# EAGLE design Rocket_End_Relays (EAGLE 7.3.0)
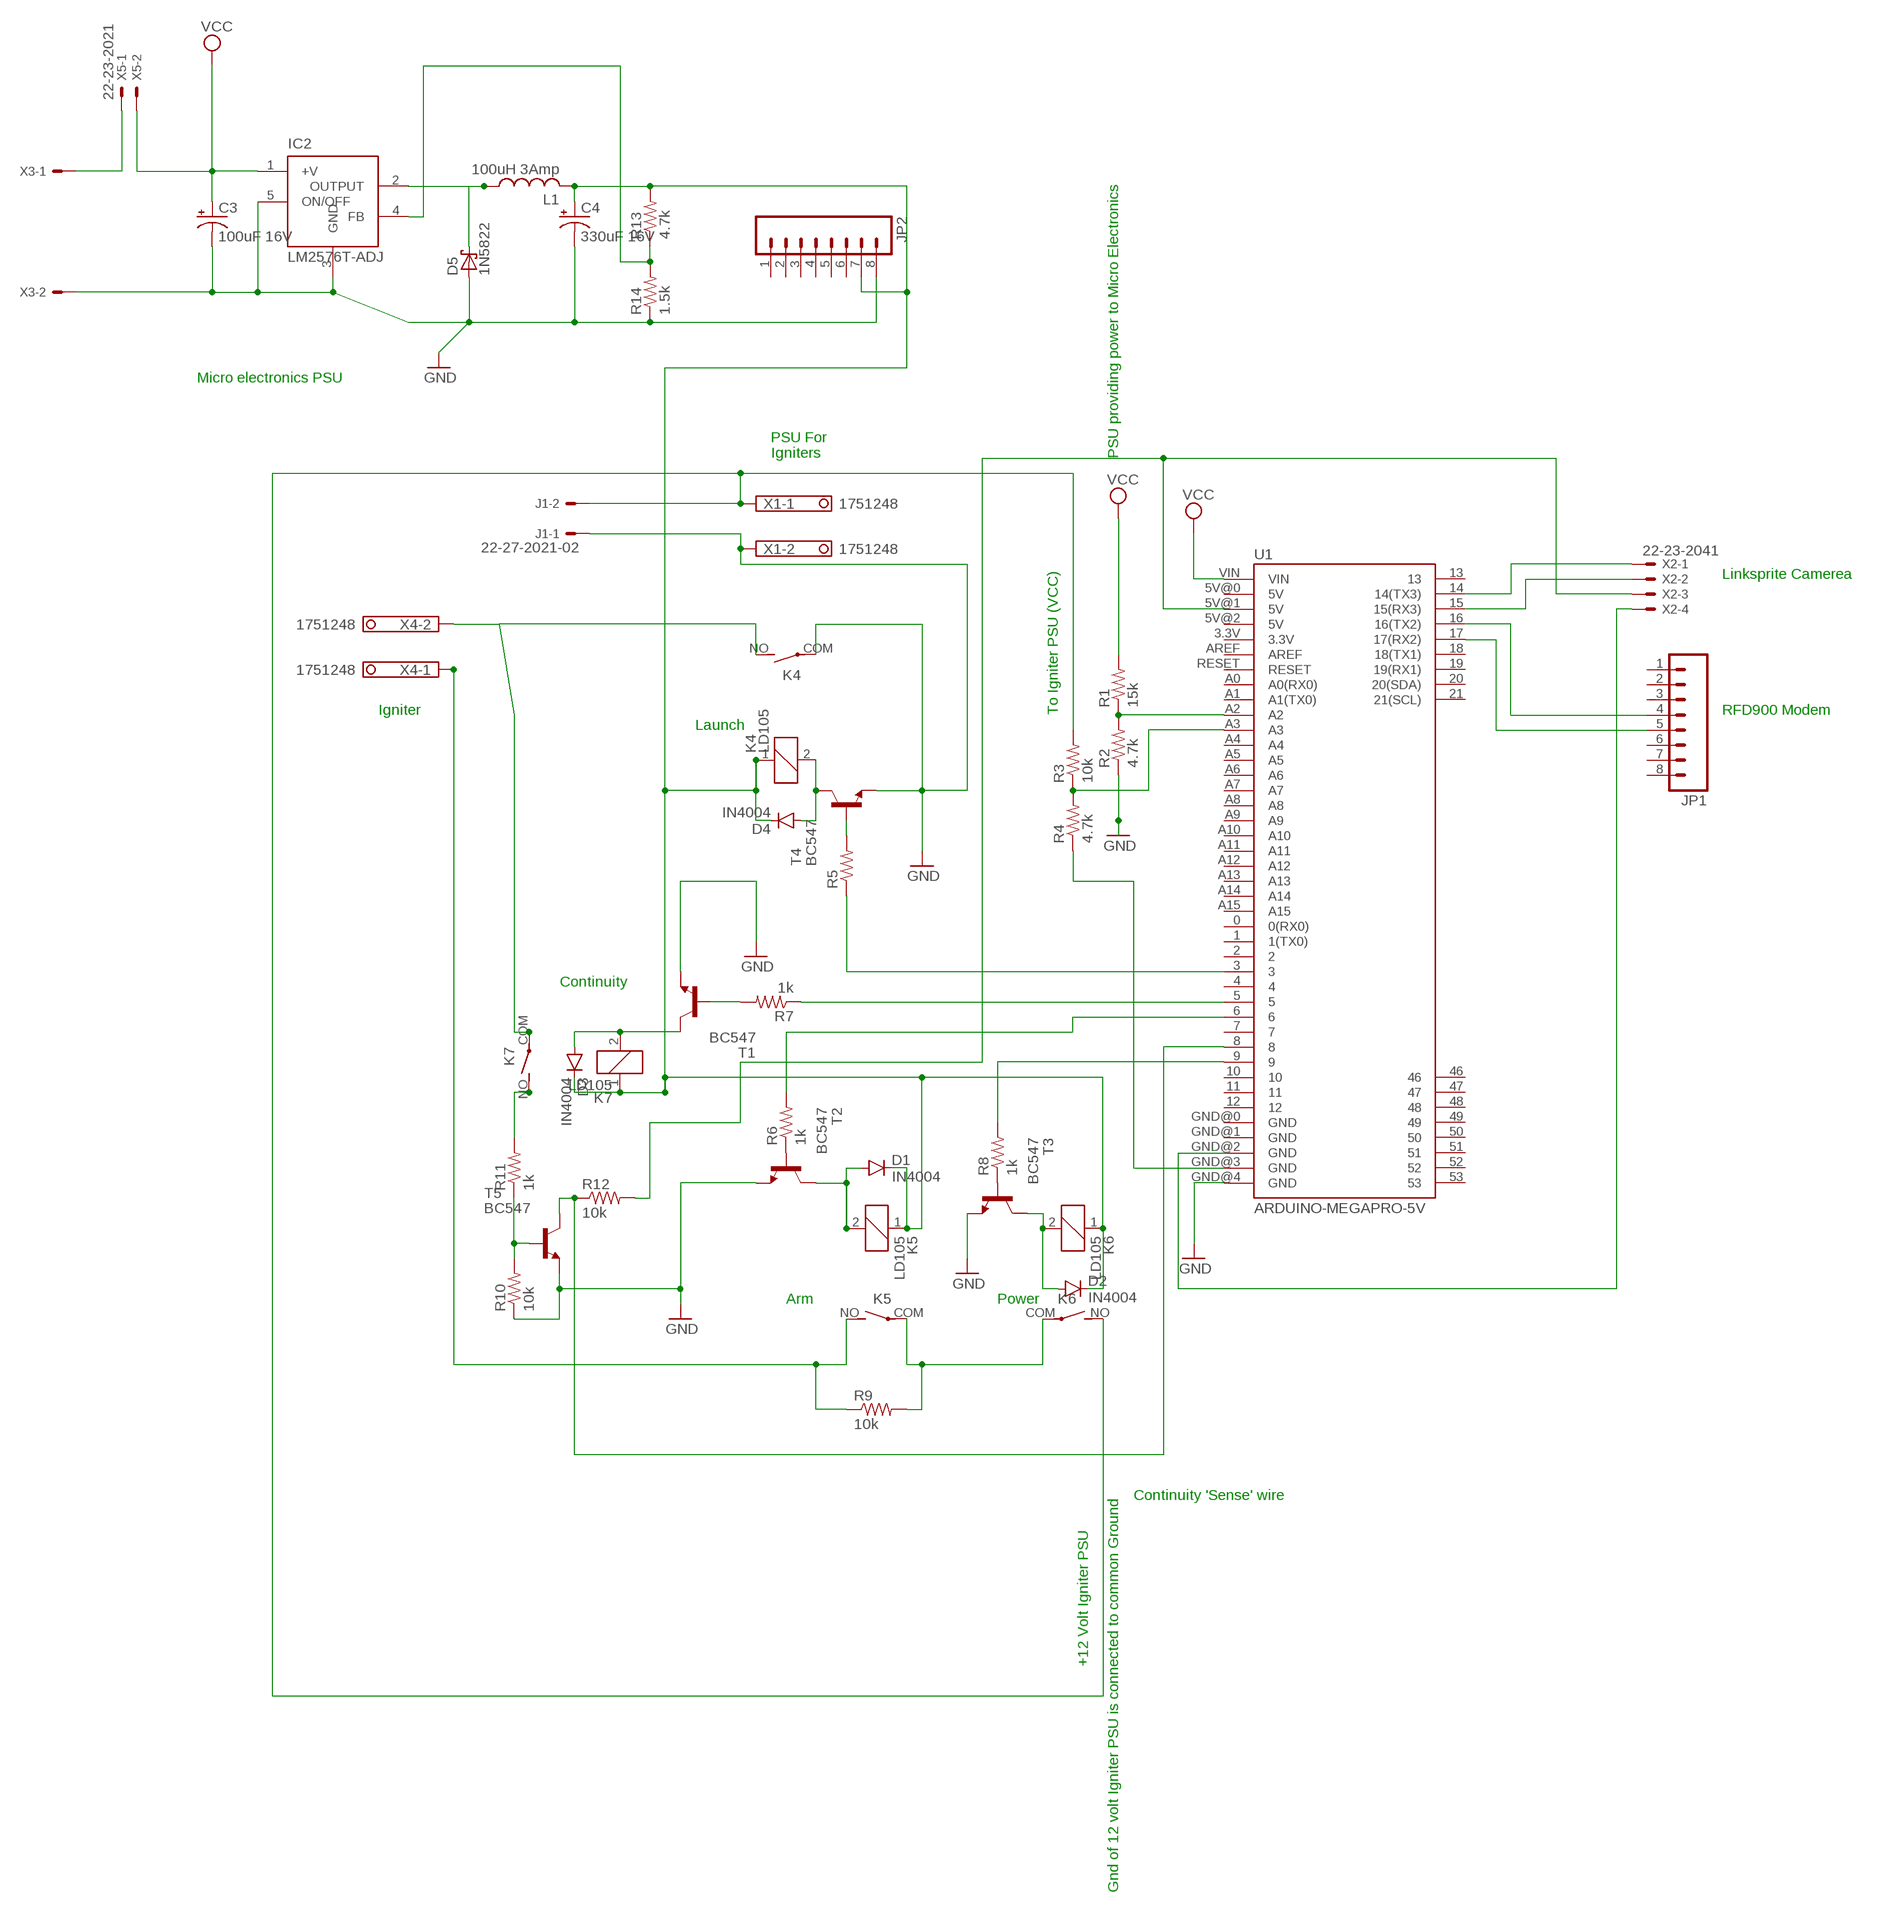
[diagram p0: schematic, sheet 1]

## Parts
C3  100uF 16V  CPOL-USE2-4  [E2-4]
C4  330uF 16V  CPOL-USE2-4  [E2-4]
D1  IN4004  DIODE1N4148  [DIODE-1N4148]
D2  IN4004  DIODE1N4148  [DIODE-1N4148]
D3  IN4004  DIODE1N4148  [DIODE-1N4148]
D4  IN4004  DIODE1N4148  [DIODE-1N4148]
D5  1N5822  1N5908  [C4111-15]
IC2  LM2576T-ADJ  [TO220-5]
J1  22-27-2021-02  [6410-02]
JP1  M08  [1X08_ROUND]
JP2  M08  [1X08_ROUND]
K4  LD105  [LD]
K5  LD105  [LD]
K6  LD105  [LD]
K7  LD105  [LD]
L1  100uH 3Amp  L-USTJ4-U1  [TJ4-U1]
R1  15k  R-US_0204/7  [0204/7]
R2  4.7k  R-US_0204/7  [0204/7]
R3  10k  R-US_0204/7  [0204/7]
R4  4.7k  R-US_0204/7  [0204/7]
R5  R-US_0204/7  [0204/7]
R6  1k  R-US_0204/7  [0204/7]
R7  1k  R-US_0204/7  [0204/7]
R8  1k  R-US_0204/7  [0204/7]
R9  10k  R-US_0204/7  [0204/7]
R10  10k  R-US_0207/7  [0207/7]
R11  1k  R-US_0207/12  [0207/12]
R12  10k  R-US_0204/7  [0204/7]
R13  4.7k  R-US_0204/2V  [0204V]
R14  1.5k  R-US_0207/7  [0207/7]
T1  BC547  [TO92]
T2  BC547  [TO92]
T3  BC547  [TO92]
T4  BC547  [TO92]
T5  BC547  [TO92]
U1  ARDUINO-MEGAPRO-5V  [ARDUINO_MEGA-PRO-5V]
X1  1751248  [1751248]
X2  22-23-2041  [22-23-2041]
X3  22-23-2021  [22-23-2021]
X4  1751248  [1751248]
X5  22-23-2021  [22-23-2021]

## Nets
N$1: JP1.4 U1.16(16(TX2))
N$2: JP1.5 U1.17(17(RX2))
N$3: R3.1 R4.2 U1.A3
N$4: R7.1 U1.5
N$5: C4.+ D1.C D2.C D3.C D4.C JP2.7 K4.1 K5.1 K6.1 K7.1 L1.2 R13.2
N$6: U1.14(14(TX3)) X2.1
N$7: R1.1 R2.2 U1.A2
N$8: R5.1 U1.3
N$9: R6.2 U1.6
N$10: R6.1 T2.2(B)
N$11: R8.1 T3.2(B)
N$12: R5.2 T4.2(B)
N$13: R7.2 T1.2(B)
N$14: R8.2 U1.9
N$15: K4.NO(2:S) K7.COM(2:P) X4.2
N$16: U1.GND@2(GND) X2.4
N$17: K5.NO(2:S) R9.1 X4.1
N$18: X3.1 X5.1
N$19: D4.A K4.2 T4.3(C)
N$20: D3.A K7.2 T1.3(C)
N$21: D2.A K6.2 T3.3(C)
N$22: D1.A K5.2 T2.3(C)
N$23: R12.2 U1.5V@1(5V) X2.3
N$24: R4.1 U1.GND@3(GND)
N$26: R12.1 T5.3(C) U1.8
N$27: U1.15(15(RX3)) X2.2
N$28: K5.COM(2:P) K6.COM(2:P) R9.2
N$29: J1.2 K6.NO(2:S) R3.2 X1.1
N$30: K7.NO(2:S) R11.2
N$31: R10.2 R11.1 T5.2(B)
N$33: C3.- C4.- D5.A IC2.3(GND) IC2.5(ON/OFF) J1.1 JP2.8 K4.COM(2:P) R2.1 R10.1 R14.1 T1.1(E) T2.1(E) T3.1(E) T4.1(E) T5.1(E) U1.GND@4(GND) X1.2 X3.2 ; supply symbol labelled GND
N$36: D5.C IC2.2(OUTPUT) L1.1
N$37: IC2.4(FB) R13.1 R14.2
VCC: C3.+ IC2.1(+V) R1.2 U1.VIN X5.2
Unconnected: JP1.1 JP1.2 JP1.3 JP1.6 JP1.7 JP1.8 JP2.1 JP2.2 JP2.3 JP2.4 JP2.5 JP2.6 U1.0(0(RX0)) U1.1(1(TX0)) U1.2 U1.3.3V U1.4 U1.5V@0(5V) U1.5V@2(5V) U1.7 U1.10 U1.11 U1.12 U1.13 U1.18(18(TX1)) U1.19(19(RX1)) U1.20(20(SDA)) U1.21(21(SCL)) U1.46 U1.47 U1.48 U1.49 U1.50 U1.51 U1.52 U1.53 U1.A0(A0(RX0)) U1.A1(A1(TX0)) U1.A4 U1.A5 U1.A6 U1.A7 U1.A8 U1.A9 U1.A10 U1.A11 U1.A12 U1.A13 U1.A14 U1.A15 U1.AREF U1.GND@0(GND) U1.GND@1(GND) U1.RESET

## Notes on the sheet
- Micro electronics PSU
- PSU For
  Igniters
- PSU providing power to Micro Electronics
- Linksprite Camerea
- Igniter | To Igniter PSU (VCC) | RFD900 Modem
- Launch
- Continuity
- Arm | Power
- Continuity 'Sense' wire
- +12 Volt Igniter PSU
- Gnd of 12 volt Igniter PSU is connected to common Ground

## Library data of the parts
C3 C4 = rcl:CPOL-US: POLARIZED CAPACITOR, American symbol
D1-D4 = SparkFun-DiscreteSemi:DIODE: Diode These are standard reverse protection diodes and small signal diodes. SMA package can handle up to about 1A. SOD-323 can handle about 200mA. What the SOD-323 package when ordering, there are some mfgs out there that are 5-pin packages.
D5 = diode:1N5908: DIODE schottky
IC2 = LM2576:LM2576*: Switching Step-Down Voltage Regulator Capable of 3A output current. Wide input voltage range. Temp range -40 to 125 C
J1 = con-molex:22-?-02: CONNECTOR wire to board 2.54 mm (.1 inch) pitch header; OC_FARNELL: unknown; OC_NEWARK: unknown
JP1 JP2 = SparkFun-Connectors:M08: Header 8 Standard 8-pin 0.1" header. Use with straight break away headers (SKU : PRT-00116), right angle break away headers (PRT-00553), swiss pins (PRT-00743), machine pins (PRT-00117), and female headers (PRT-00115).
K4-K7 = relay:LD?*: Slim Power Relay NAiS Source: http://www.mew-europe.com/.. en_ds_61112_0000.pdf; OC_FARNELL: 3727154; OC_NEWARK: unknown
L1 = resistor:L-US: INDUCTOR, American symbol
R1-R4 R9 R10 = rcl:R-US_: RESISTOR, American symbol
R5-R8 R11-R14 = resistor:R-US_: RESISTOR, American symbol
T1-T4 = transistor-neu-to92:BC547: NPN TRANSISTOR
T5 = transistor:BC547: NPN TRANSISTOR
U1 = Joe_SparkFun-Boards:ARDUINO-MEGA: Arduino Mega board footprint
X1 X4 = con-phoenix-350:1751248: MKDS 1/ 2-3,5 Printklemme Nennstrom: 10 A Bemessungsspannung: 160 V Raster: 3,5 mm Polzahl: 2 Montageart: Löten Anschlussart: Schraubanschluss Anschlussrichtung vom Leiter zur Platine: 0° Source: http://eshop.phoenixcontact.com .. 1751248.pdf; OC_FARNELL: unknown; OC_NEWARK: unknown
X2 = con-molex:22-23-2041: .100" (2.54mm) Center Header - 4 Pin; MF: MOLEX; MPN: 22-23-2041; OC_FARNELL: 1462920; OC_NEWARK: 38C0355
X3 X5 = con-molex:22-23-2021: .100" (2.54mm) Center Header - 2 Pin; MF: MOLEX; MPN: 22-23-2021; OC_FARNELL: 1462926; OC_NEWARK: 25C3832

## Board
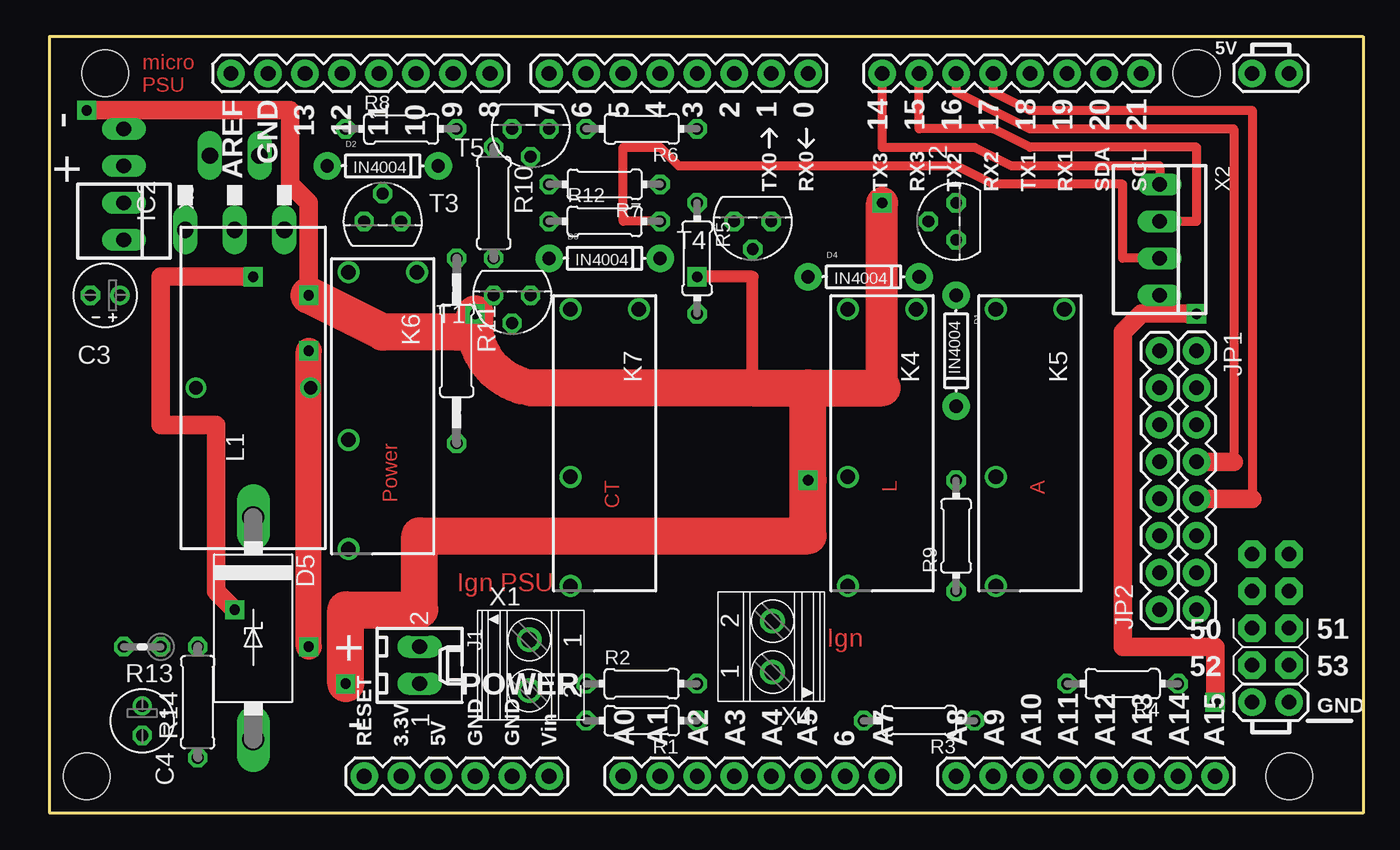
[diagram p1: board, top side]
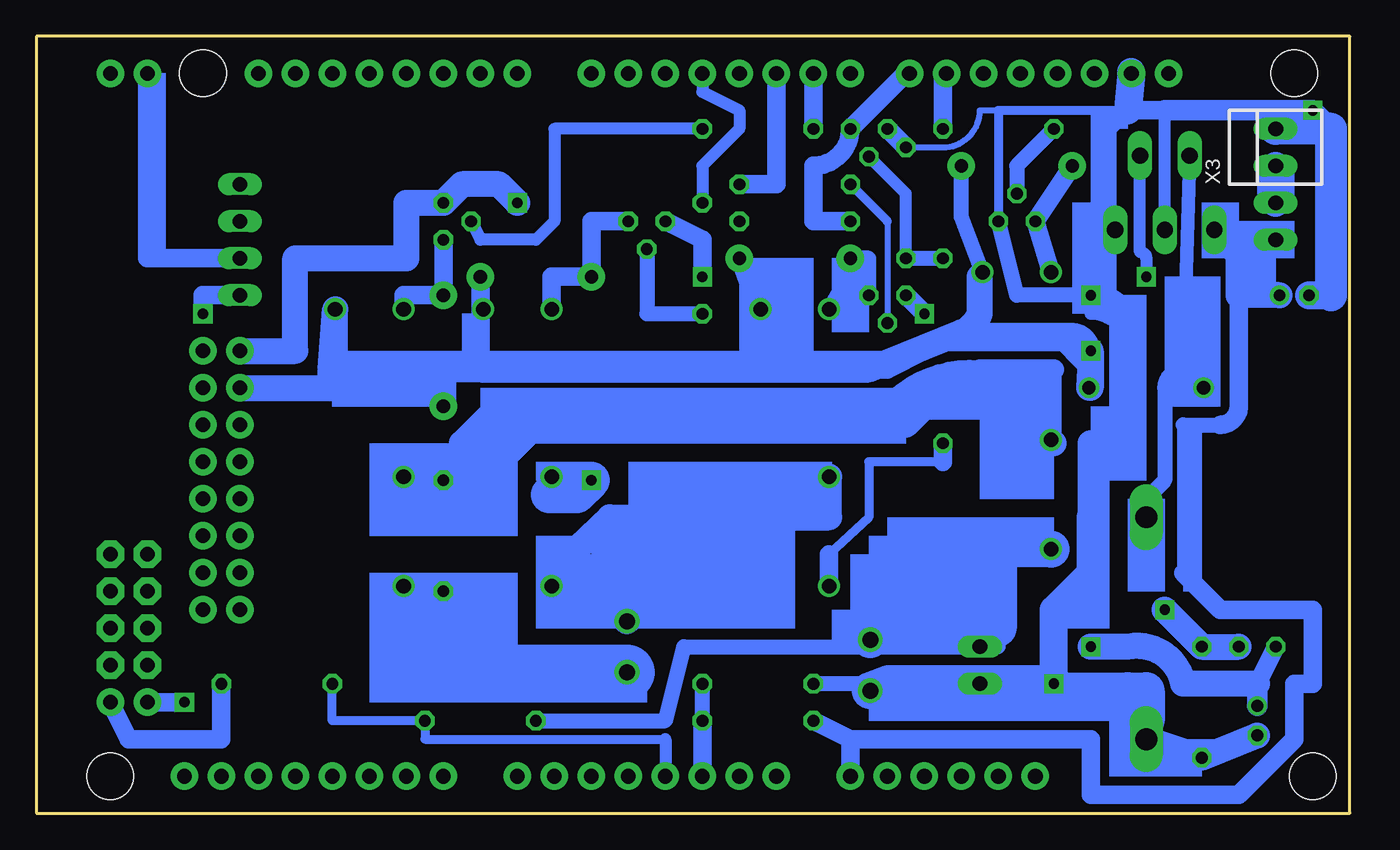
[diagram p2: board, bottom side, seen from below]

Size 90.17 x 53.34 mm. Coordinates in mm from the lower left corner, seen from the top.
Copper layers (1*16): Top 0.035mm / dielectric 1.5mm / Bottom 0.035mm
Design rules "default *": minimum track width 10mil, minimum drill 24mil, track to track 8mil, track to pad 8mil, pad to pad 8mil, via to via 8mil, smd to smd 8mil, copper to edge 40mil, drill to drill 8mil, minimum pad ring 10mil, minimum via ring 12mil, stop-mask expansion 4mil, vias tented up to drill 0mil, thermal gap 10mil

### Footprints (pad centres in the part's own frame; a part is rotated, then mirrored left to right if it is on the bottom)
E2-4 = drill 0.813 pad 1.27: + -1.016,0 | drill 0.813 pad 1.27 octagon: - 1.016,0
DIODE-1N4148 = drill 0.9 pad 1.88: A -3.81,0; C 3.81,0
C4111-15 = drill 1.499 long: A 7.62,0; C -7.62,0
TO220-5 = drill 1.118 pad 1.626 long: 1 -3.404,-8.211; 2 -1.702,-3.105; 3 0,-8.211; 4 1.702,-3.105; 5 3.404,-8.211
6410-02 = drill 1.016 long: 1 1.27,0; 2 -1.27,0
1X08_ROUND = drill 1.016 pad 1.88: 1 0,0; 2 2.54,0; 3 5.08,0; 4 7.62,0; 5 10.16,0; 6 12.7,0; 7 15.24,0; 8 17.78,0
LD = drill 1: 1 -9.2,2.35; 2 -9.2,-2.35; COM 2.3,-2.35; NO 9.8,-2.35
TJ4-U1 = drill 0.9: 1 -3.935,0; 2 3.935,0
0204/7 = drill 0.813 octagon: 1 -3.81,0; 2 3.81,0
0207/7 = drill 0.813 octagon: 1 -3.81,0; 2 3.81,0
0207/12 = drill 0.813 octagon: 1 -6.35,0; 2 6.35,0
0204V = drill 0.813 octagon: 1 -1.27,0; 2 1.27,0
TO92 = drill 0.813 octagon: 1 1.27,0; 2 0,1.905; 3 -1.27,0
ARDUINO_MEGA-PRO-5V = drill 1.016 pad 1.88: 0 52.07,50.8; 1 49.53,50.8; 2 46.99,50.8; 3 44.45,50.8; 3.3V 24.13,2.54; 4 41.91,50.8; 5 39.37,50.8; 5V@0 26.67,2.54; 5V@1 82.55,50.8; 5V@2 85.09,50.8; 6 36.83,50.8; 7 34.29,50.8; 8 30.226,50.8; 9 27.686,50.8; 10 25.146,50.8; 11 22.606,50.8; 12 20.066,50.8; 13 17.526,50.8; 14 57.15,50.8; 15 59.69,50.8; 16 62.23,50.8; 17 64.77,50.8; 18 67.31,50.8; 19 69.85,50.8; 20 72.39,50.8; 21 74.93,50.8; A0 39.37,2.54; A1 41.91,2.54; A2 44.45,2.54; A3 46.99,2.54; A4 49.53,2.54; A5 52.07,2.54; A6 54.61,2.54; A7 57.15,2.54; A8 62.23,2.54; A9 64.77,2.54; A10 67.31,2.54; A11 69.85,2.54; A12 72.39,2.54; A13 74.93,2.54; A14 77.47,2.54; A15 80.01,2.54; AREF 12.446,50.8; GND@0 29.21,2.54; GND@1 31.75,2.54; GND@2 82.55,7.62; GND@3 85.09,7.62; GND@4 14.986,50.8; RESET 21.59,2.54; VIN 34.29,2.54 | drill 1.016 pad 1.88 octagon: 46 82.55,17.78; 47 85.09,17.78; 48 82.55,15.24; 49 85.09,15.24; 50 82.55,12.7; 51 85.09,12.7; 52 82.55,10.16; 53 85.09,10.16 | hole 3.2: 3.81,50.8; 2.54,2.54; 78.74,50.8; 85.09,2.54
1751248 = drill 1.1 pad 1.7: 1 -1.75,-0.1; 2 1.75,-0.1
22-23-2041 = drill 1 long: 1 -3.81,0; 2 -1.27,0; 3 1.27,0; 4 3.81,0
22-23-2021 = drill 1 long: 1 -1.27,0; 2 1.27,0

### Placement (x,y rotation side)
C3  3.81,35.56 180 top
C4  6.35,6.35 270 top
D1  62.23,31.75 270 top
D2  22.86,44.45 0 top
D3  38.1,38.1 0 top
D4  55.88,36.83 0 top
D5  13.97,12.7 270 top
IC2  12.7,48.26 0 top
J1  25.4,10.16 270 top
JP1  78.74,31.75 270 top
JP2  76.2,13.97 90 top
K4  57.15,25.4 270 top
K5  67.31,25.4 270 top
K6  22.86,27.94 270 top
K7  38.1,25.4 270 top
L1  13.97,29.21 0 top
R1  40.64,6.35 180 top
R2  40.64,8.89 0 top
R3  59.69,6.35 180 top
R4  73.66,8.89 180 top
R5  44.45,38.1 270 top
R6  40.64,46.99 180 top
R7  38.1,43.18 180 top
R8  24.13,46.99 0 top
R9  62.23,19.05 90 top
R10  30.48,41.91 270 top
R11  27.94,31.75 270 top
R12  38.1,40.64 0 top
R13  6.35,11.43 180 top
R14  10.16,7.62 90 top
T1  31.75,35.56 180 top
T2  62.23,40.64 90 top
T3  22.86,40.64 0 top
T4  48.26,40.64 180 top
T5  33.02,46.99 180 top
U1  0,0 0 top
X1  33.02,10.16 270 top
X2  76.2,39.37 270 top
X3  5.08,45.72 90 bottom
X4  49.53,11.43 90 top
X5  5.08,40.64 270 top

### Tracks (layer width: path | path; a pad name or v marks a point on that pad's centre or on a via)
N$1
  Top 0.61: U1.16 62.23,49.53 67.31,46.99 81.28,46.99 81.28,24.13
  Top 1.27: 81.28,24.13 JP1.4
N$2
  Top 0.61: U1.17 64.77,49.53 67.31,48.26 82.55,48.26 82.55,21.59
  Top 1.27: 82.55,21.59 JP1.5
N$3
  Bottom 0.61: R4.2 69.85,6.35 R3.1 63.5,5.08 46.99,5.08
  Bottom 0.813: 46.99,5.08 U1.A3
N$4
  Bottom 1.27: R7.1 39.37,43.18 U1.5
N$5  (via drill 0.7)
  Top 1.778: v17.78,11.43 v17.78,31.75
  Bottom 0.254: K6.1 25.22,37.19 25.4,36.83 | 67.72,30.1 69.66,30.48 67.28,29.64 | 69.8,34.21 69.85,34.29 | 69.8,33.76 K5.1
  Bottom 1.016: K4.1 59.69,34.6 | 40.64,34.6 K7.1 40.45,30.48 | K6.1 26.67,40.95 D2.C | 26.67,33.02 25.4,33.02 | D4.C 59.69,35.56
  Bottom 1.27: D4.C 59.69,34.6 59.69,30.48 | 40.64,34.6 D3.C | 33.02,30.48 31.75,30.48 26.67,33.02 | R13.2 6.35,8.89 | 20.32,33.02 25.4,33.02 25.4,34.29 | 20.32,33.02 arc90 17.78,30.48 20.32,33.02 | 20.32,33.02 19.05,33.02 arc90 v17.78,31.75 | 69.8,33.76 69.8,34.21
  Bottom 1.422: 6.35,8.89 C4.+
  Bottom 1.778: 62.23,30.48 59.69,30.48 40.45,30.48 33.02,30.48 26.67,33.02 arc-46 25.4,34.29 25.4,36.83 | 62.23,30.48 69.66,30.48 K5.1 69.97,30.48 69.97,29.33 69.85,29.21 JP2.7 | v17.78,11.43 15.24,11.43 arc90 11.43,8.89 6.35,8.89 | L1.2 v17.78,31.75 17.78,30.48 17.78,29.21 | D1.C 62.23,30.48
N$6
  Top 0.61: U1.14 57.15,45.72 63.5,45.72 66.04,44.45 76.2,44.45 X2.1
N$7
  Bottom 1.016: R1.1 R2.2
  Bottom 1.27: U1.A2 R1.1
N$8
  Bottom 0.813: U1.3 44.45,49.53 41.91,48.26 41.91,46.99 44.45,44.45 R5.1
N$9
  Bottom 1.27: R6.2 U1.6
N$10
  Bottom 0.813: R6.1 54.61,46.99 54.61,40.64 55.88,39.37 59.69,39.37 T2.2
N$11
  Bottom 1.016: R8.1 22.86,44.45 T3.2
N$12
  Bottom 1.016: T4.2 48.26,34.29 R5.2
N$13
  Bottom 0.406: 31.75,40.64 T1.2
  Bottom 0.61: 31.75,40.64 R7.2
N$14
  Bottom 0.406: 27.94,50.55 U1.9
  Bottom 1.27: R8.2 27.94,50.55
N$15
  Bottom 0.254: 51.6,18.58 52.2,17.98 52.93,18.29
  Bottom 0.406: K4.NO 54.61,14.33
  Bottom 0.813: 54.8,13.97 K4.NO
  Bottom 1.778: 54.61,14.33 52.93,18.29 50.8,20.32 35.75,20.32 K7.COM | 52.07,19.05 51.6,18.58 47.79,18.58 46.99,17.78 46.99,15.82 X4.2
N$16  (via drill 0.7)
  Top 1.27: v80.01,7.62 80.01,11.43 73.66,11.43 73.66,33.02 74.93,34.29 v78.74,34.29
  Bottom 1.27: U1.GND@2 v80.01,7.62 | v78.74,34.29 78.74,35.56 X2.4
N$17
  Bottom 1.778: R9.1 63.5,13.97 64.77,13.97 64.77,14.52 K5.NO
  Bottom 3.81: X4.1 63.02,9.68 63.5,10.16 63.5,13.97
N$18
  Bottom 1.93: X3.1 X5.1
N$19
  Bottom 1.27: K4.2 54.8,36.83 D4.A 52.07,40.64 T4.3
N$20
  Bottom 1.016: K7.2 34.48,36.83 D3.A 33.02,38.1 T1.3
N$21
  Bottom 1.27: K6.2 T3.3 D2.A
N$22
  Bottom 1.27: K5.2 64.96,35.56 D1.A T2.3
N$23
  Top 0.61: R12.2 39.37,40.64 39.37,45.72 41.91,45.72 43.18,44.45 62.23,44.45 64.77,43.18 73.66,43.18 73.66,38.1 X2.3
  Bottom 1.27: X2.3 82.55,38.1 U1.5V@1
N$24
  Bottom 1.27: U1.GND@3 83.82,5.08 77.47,5.08 R4.1
N$25
  Bottom 1.016: 33.02,11.43 24.13,11.43
N$26
  Bottom 0.406: U1.8 30.48,50.8
  Bottom 1.27: 30.48,50.8 T5.3 arc90 36.83,44.45 36.83,40.64 R12.1
N$27
  Top 0.61: X2.2 78.74,40.64 78.74,45.72 67.31,45.72 64.77,46.99 59.69,46.99 U1.15
N$28
  Bottom 0.406: K6.COM 20.32,25.64 20.32,25.4
  Bottom 0.813: 25.4,30.48 arc90 21.59,26.67
  Bottom 1.016: 20.32,30.48 20.32,25.83 K6.COM
  Bottom 1.27: 25.4,30.48 arc-53 31.75,27.94 | K5.COM 64.77,21.83 | 25.4,30.48 arc90 21.59,26.67 | 25.4,30.48 22.86,29.21
  Bottom 1.422: 20.32,30.48 25.4,30.48
  Bottom 1.676: 31.75,27.94 39.37,27.94
  Bottom 1.778: 31.75,26.67 30.48,26.67 29.21,27.94 22.86,27.94 20.32,25.4 | 64.77,21.83 R9.2 59.69,25.4 55.88,27.94 39.37,27.94
N$29
  Bottom 0.406: J1.2 25.4,12.7
  Bottom 1.016: R3.2 46.99,6.35 45.72,11.43 33.02,11.43 32.57,12.25
  Bottom 2.54: K6.NO 23.77,18.14 24.13,17.78 24.13,12.7 25.4,12.7 32.13,12.7 32.57,12.25 X1.1
N$30
  Bottom 0.61: 27.94,24.13 33.02,24.13 33.02,20.32 35.75,17.78
  Bottom 1.27: R11.2 27.94,24.13 | 35.75,17.78 K7.NO
N$31
  Bottom 0.813: R10.2 30.48,42.55 T5.2
  Bottom 1.016: R10.2 R11.1
N$33  (via drill 0.7)
  Top 0.254: 32.08,28.5 32.34,29.36
  Top 0.813: 48.26,29.21 48.26,36.83 v44.45,36.83
  Top 1.27: v17.78,35.56 17.78,41.91 16.51,43.18 16.51,48.26 v2.54,48.26
  Top 1.778: v29.21,34.29 arc-90 27.94,33.02 | 33.02,29.21 arc-9 32.34,29.36
  Top 2.184: 57.15,29.21 v57.15,41.91
  Top 2.54: 52.07,29.21 48.26,29.21 33.02,29.21 | 52.07,29.21 57.15,29.21 | 27.94,33.02 22.86,33.02 v17.78,35.56 | 32.34,29.36 arc-81 v29.21,34.29 | 52.07,29.21 v52.07,22.86 52.07,19.05 25.4,19.05 25.4,13.97 20.32,13.97 v20.32,8.89
  Bottom 0.254: U1.GND@4 15.16,50.9 15,50.89
  Bottom 0.406: R10.1 27.94,45.72 arc-90 25.4,48.26 24.13,48.26 | D5.A 13.97,7.62 | K4.COM 54.61,23.1 54.61,21.87
  Bottom 0.61: 15.24,48.26 24.13,48.26 T3.1 | IC2.5 16.51,40.64 | v17.78,35.56 17.78,34.29
  Bottom 0.813: 16.51,35.56 arc90 17.78,34.29 arc90 15.24,31.75 | IC2.3 12.7,48.26
  Bottom 1.016: 14.99,51.05 15,50.89 | 16.51,35.56 16.51,40.64 16.51,46.99 15.24,48.26 | T3.1 22.86,35.56 v17.78,35.56 arc90 15.24,34.29 15.24,31.75 15.24,25.4 | 31.65,8.89 R2.1
  Bottom 1.27: 15.24,48.26 12.7,48.26 | v44.45,36.83 44.45,39.37 T4.1 | T1.1 v29.21,34.29 | T5.1 R10.1 | 17.78,25.4 15.24,25.4 | J1.1 15.72,8.89 15.24,8.41
  Bottom 1.422: 12.7,48.26 v2.54,48.26 1.27,46.99
  Bottom 1.778: v57.15,41.91 58.42,43.18 60.96,43.18 T2.1 64.77,41.91 64.77,38.1 72.39,38.1 72.39,31.75 JP2.8 | C4.- R14.1 D5.A | 17.78,20.32 17.78,25.4
  Bottom 1.93: 15,50.89 15.24,48.26 | v20.32,8.89 20.32,13.97 17.78,16.51 17.78,20.32 | C3.- 1.27,35.56
  Bottom 2.184: X3.2 1.27,46.99 1.27,35.56
  Bottom 2.54: 54.94,21.87 54.61,21.87 53.06,21.87 v52.07,22.86 | 13.97,6.35 13.97,7.62 13.97,8.41 15.24,8.41 X1.2 31.65,8.89 J1.1 v20.32,8.89
N$34
  Bottom 1.778: 59.69,22.86 55.88,26.67
N$35
  Bottom 1.778: 60.96,25.4 58.42,27.94
N$36
  Bottom 0.914: IC2.2 11.43,30.48
  Bottom 1.016: D5.C 13.97,21.59 12.7,22.86 12.7,29.21 arc90 11.43,30.48
  Bottom 1.27: L1.1 11.43,30.48
N$37  (via drill 0.7)
  Top 1.27: v12.7,13.97 11.43,15.24 11.43,26.67 7.62,26.67 7.62,36.83 v13.97,36.83
  Bottom 0.813: IC2.4 14.4,38.53 arc90 13.97,38.1 v13.97,36.83
  Bottom 1.778: v12.7,13.97 R14.2 | R14.2 R13.1 R14.2
VCC
  Bottom 0.813: 11.43,16.51 11.43,26.67
  Bottom 1.016: 11.43,26.67 8.89,26.67
  Bottom 1.27: 34.29,5.08 17.78,5.08 17.78,1.27 7.62,1.27 3.81,5.08 3.81,8.89 2.54,8.89 2.54,13.97 8.89,13.97 11.43,16.51 | 34.29,5.08 U1.VIN | R1.2 34.29,5.08 | 7.62,35.56 7.62,27.94 arc90 8.89,26.67
  Bottom 1.676: X5.2 6.76,39.37
  Bottom 1.778: C3.+ 7.62,35.56 7.62,38.37 IC2.1 6.76,39.37
(copper drawn outside any net)
  shapes: Bottom area x78

### Text on the board
Top: micro / PSU | Power | CT | L | A | Ign PSU | Ign
tPlace: - | + | + | -